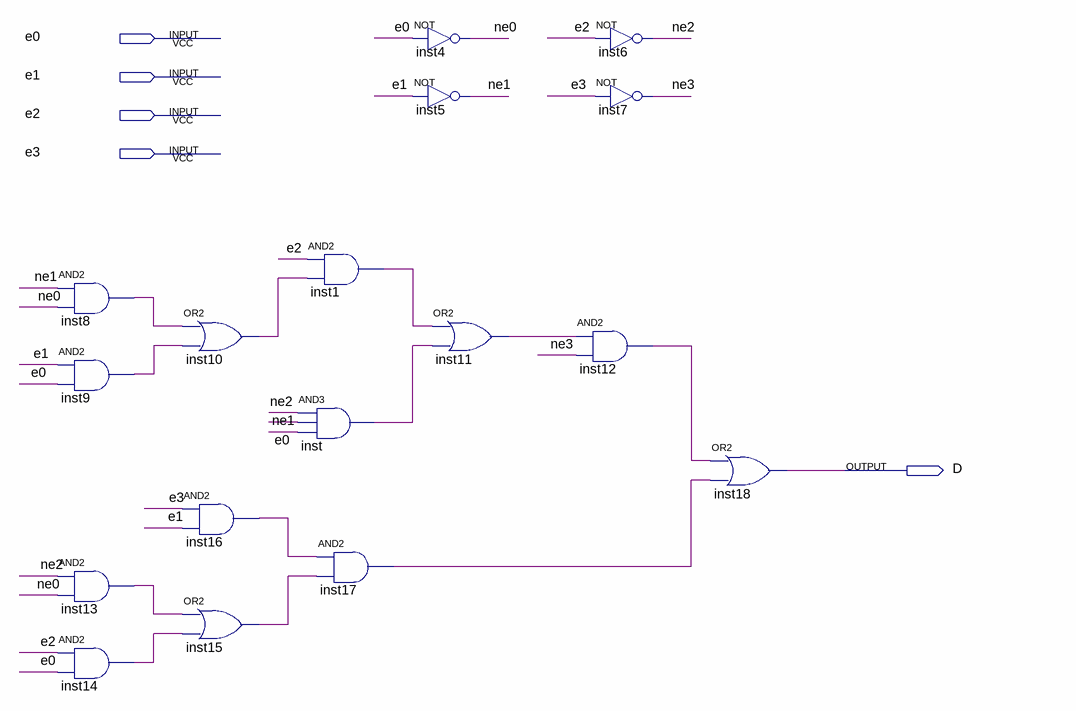
[diagram p0: schematic sheet]
// Quartus schematic letraD.bdf as structural Verilog: 17 symbols, 5 pins
module letraD (
  input  e0,
  input  e1,
  input  e2,
  input  e3,
  output D
);

  wire inst1_out, inst8_out, inst9_out, inst10_out, inst11_out, inst12_out, inst13_out, inst14_out,
       inst15_out, inst16_out, inst17_out, inst_out, ne0, ne1, ne2, ne3;

  and inst8 (inst8_out, ne1, ne0);
  and inst9 (inst9_out, e1, e0);
  and inst13 (inst13_out, ne2, ne0);
  and inst14 (inst14_out, e2, e0);
  or inst10 (inst10_out, inst8_out, inst9_out);
  and inst16 (inst16_out, e3, e1);
  or inst15 (inst15_out, inst13_out, inst14_out);
  and inst1 (inst1_out, e2, inst10_out);
  and inst (inst_out, ne2, ne1, e0);
  and inst17 (inst17_out, inst16_out, inst15_out);
  not inst4 (ne0, e0);
  not inst5 (ne1, e1);
  or inst11 (inst11_out, inst1_out, inst_out);
  not inst6 (ne2, e2);
  not inst7 (ne3, e3);
  and inst12 (inst12_out, inst11_out, ne3);
  or inst18 (D, inst12_out, inst17_out);
endmodule
